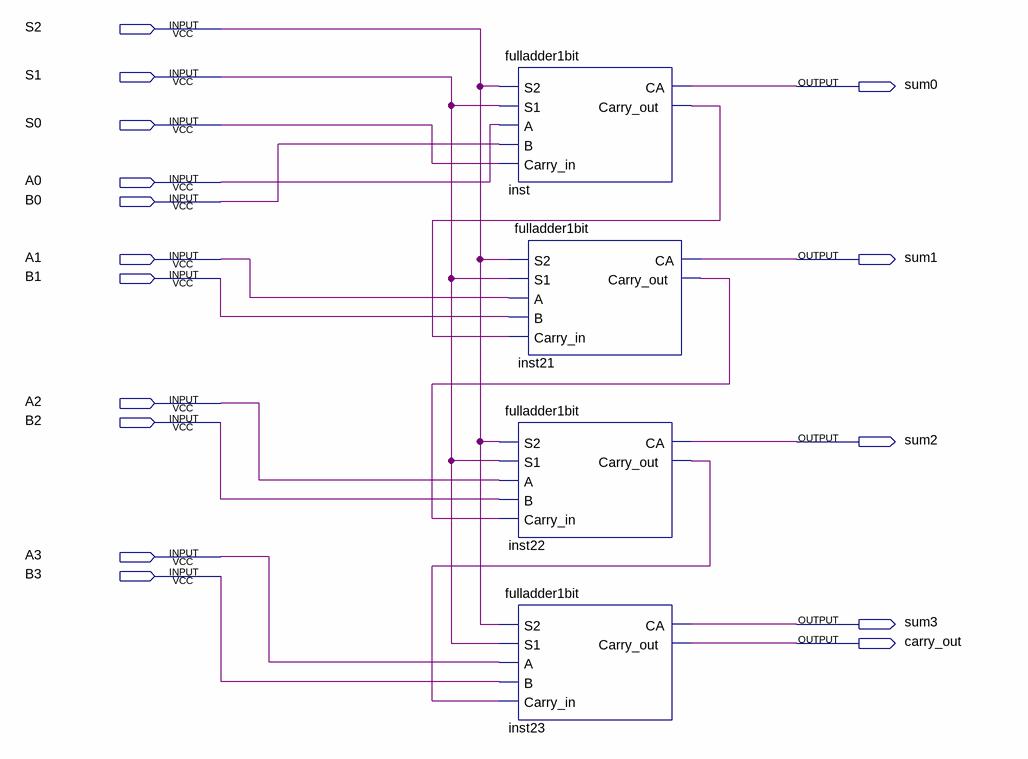
[diagram p0: schematic sheet]
// Quartus schematic arithcircuit4bits.bdf as structural Verilog: 4 symbols, 16 pins
module arithcircuit4bits (
  input  S2,
  input  S1,
  input  S0,
  input  A0,
  input  B0,
  input  A1,
  input  B1,
  input  A2,
  input  B2,
  input  A3,
  input  B3,
  output sum0,
  output sum1,
  output sum2,
  output sum3,
  output carry_out
);

  wire inst21_carry_out, inst22_carry_out, inst_carry_out;

  fulladder1bit inst (.S2(S2), .S1(S1), .A(A0), .B(B0), .Carry_in(S0), .CA(sum0), .Carry_out(inst_carry_out));
  fulladder1bit inst21 (
    .S2(S2), .S1(S1), .A(A1), .B(B1), .Carry_in(inst_carry_out), .CA(sum1), .Carry_out(inst21_carry_out));
  fulladder1bit inst22 (
    .S2(S2), .S1(S1), .A(A2), .B(B2), .Carry_in(inst21_carry_out), .CA(sum2), .Carry_out(inst22_carry_out));
  fulladder1bit inst23 (
    .S2(S2), .S1(S1), .A(A3), .B(B3), .Carry_in(inst22_carry_out), .CA(sum3), .Carry_out(carry_out));
endmodule
